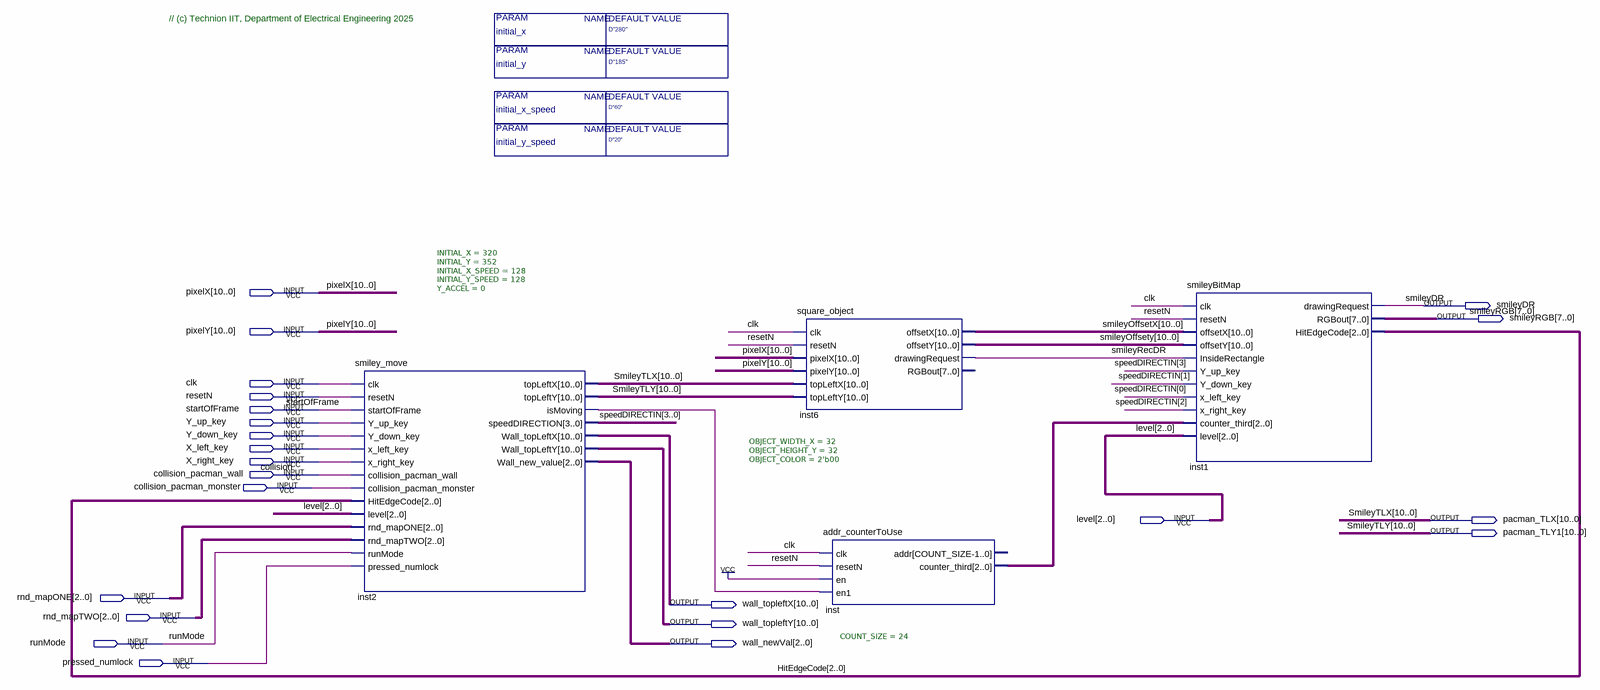
[diagram p0: schematic sheet]
// Quartus schematic Smiley_Block_T.bdf as structural Verilog: 4 symbols, 23 pins
module Smiley_Block_T #(parameter initial_x = "D\"280\"", parameter initial_y = "D\"185\"", parameter initial_x_speed = "D\"60\"", parameter initial_y_speed = "D\"20\"") (
  input  [10:0] pixelX,
  input  [10:0] pixelY,
  input  clk,
  input  resetN,
  input  startOfFrame,
  input  Y_up_key,
  input  Y_down_key,
  input  X_left_key,
  input  X_right_key,
  input  collision_pacman_wall,
  input  collision_pacman_monster,
  input  [2:0] level,
  input  [2:0] rnd_mapONE,
  input  [2:0] rnd_mapTWO,
  input  runMode,
  input  pressed_numlock,
  output smileyDR,
  output [7:0] smileyRGB,
  output [10:0] pacman_TLX,
  output [10:0] pacman_TLY1,
  output [10:0] wall_topleftX,
  output [10:0] wall_topleftY,
  output [2:0] wall_newVal
);

  wire inst2_ismoving, smileyRecDR;
  wire [2:0] HitEdgeCode, inst_counter_third;
  wire [3:0] speedDIRECTIN;
  wire [10:0] smileyOffsetX, smileyOffsety;

  smiley_move #(.INITIAL_X(320), .INITIAL_Y(352), .INITIAL_X_SPEED(128), .INITIAL_Y_SPEED(128), .Y_ACCEL(0)) inst2 (
    .clk(clk), .resetN(resetN), .startOfFrame(startOfFrame), .Y_up_key(Y_up_key), .Y_down_key(Y_down_key),
    .x_left_key(X_left_key), .x_right_key(X_right_key), .collision_pacman_wall(collision_pacman_wall),
    .collision_pacman_monster(collision_pacman_monster), .HitEdgeCode(HitEdgeCode), .level(level),
    .rnd_mapONE(rnd_mapONE), .rnd_mapTWO(rnd_mapTWO), .runMode(runMode), .pressed_numlock(pressed_numlock),
    .topLeftX(pacman_TLX), .topLeftY(pacman_TLY1), .isMoving(inst2_ismoving), .speedDIRECTION(speedDIRECTIN),
    .Wall_topLeftX(wall_topleftX), .Wall_topLeftY(wall_topleftY), .Wall_new_value(wall_newVal));
  square_object #(.OBJECT_WIDTH_X(32), .OBJECT_HEIGHT_Y(32), .OBJECT_COLOR(2'b00)) inst6 (
    .clk(clk), .resetN(resetN), .pixelX(pixelX), .pixelY(pixelY), .topLeftX(pacman_TLX),
    .topLeftY(pacman_TLY1), .offsetX(smileyOffsetX), .offsetY(smileyOffsety), .drawingRequest(smileyRecDR));  // open: RGBout
  addr_counterToUse #(.COUNT_SIZE(24)) inst (
    .clk(clk), .resetN(resetN), .en(1'b1), .en1(inst2_ismoving), .counter_third(inst_counter_third));  // open: addr
  smileyBitMap inst1 (
    .clk(clk), .resetN(resetN), .offsetX(smileyOffsetX), .offsetY(smileyOffsety),
    .InsideRectangle(smileyRecDR), .Y_up_key(speedDIRECTIN[3]), .Y_down_key(speedDIRECTIN[1]),
    .x_left_key(speedDIRECTIN[0]), .x_right_key(speedDIRECTIN[2]), .counter_third(inst_counter_third),
    .level(level), .drawingRequest(smileyDR), .RGBout(smileyRGB), .HitEdgeCode(HitEdgeCode));

  // Other names for the same wires on the sheet: collision = collision_pacman_wall; SmileyTLX[10:0] = pacman_TLX;
  //   SmileyTLY[10:0] = pacman_TLY1

  // Notes on the sheet:
  //   // (c) Technion IIT, Department of Electrical Engineering 2025
endmodule
